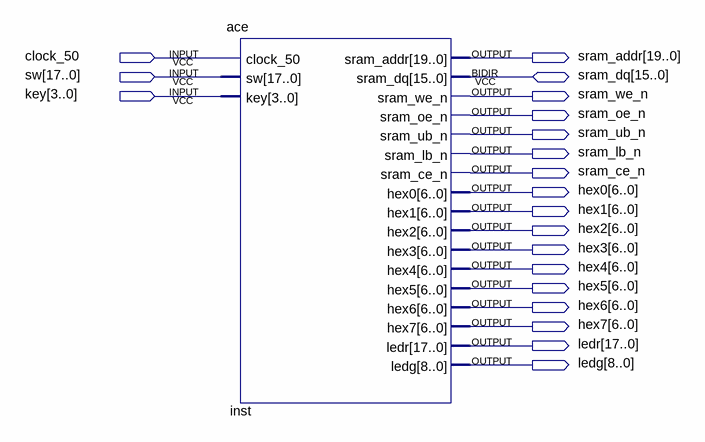
[diagram p0: schematic sheet]
// Quartus schematic ace-top.bdf as structural Verilog: 1 symbols, 20 pins
module \ace-top  (
  input  clock_50,
  input  [17:0] sw,
  input  [3:0] key,
  inout  [15:0] sram_dq,
  output [19:0] sram_addr,
  output sram_we_n,
  output sram_oe_n,
  output sram_ub_n,
  output sram_lb_n,
  output sram_ce_n,
  output [6:0] hex0,
  output [6:0] hex1,
  output [6:0] hex2,
  output [6:0] hex3,
  output [6:0] hex4,
  output [6:0] hex5,
  output [6:0] hex6,
  output [6:0] hex7,
  output [17:0] ledr,
  output [8:0] ledg
);

  ace inst (
    .clock_50(clock_50), .sw(sw), .key(key), .sram_addr(sram_addr), .sram_we_n(sram_we_n),
    .sram_oe_n(sram_oe_n), .sram_ub_n(sram_ub_n), .sram_lb_n(sram_lb_n), .sram_ce_n(sram_ce_n), .hex0(hex0),
    .hex1(hex1), .hex2(hex2), .hex3(hex3), .hex4(hex4), .hex5(hex5), .hex6(hex6), .hex7(hex7), .ledr(ledr),
    .ledg(ledg), .sram_dq(sram_dq));
endmodule
